# EAGLE schematic power_2 (EAGLE 7.2.0)
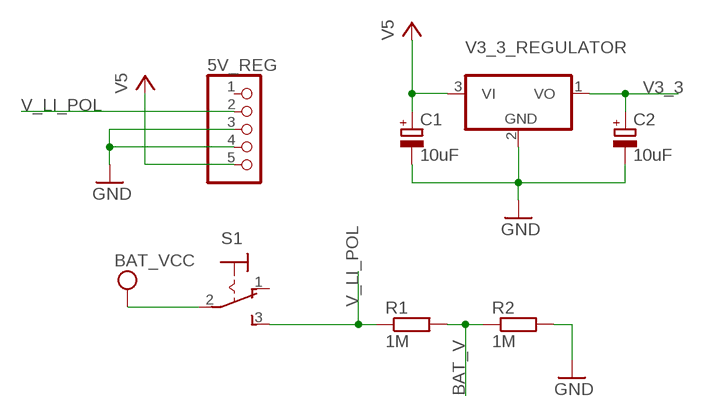
[diagram p0: schematic, sheet 1]

## Parts
5V_REG  PINHD-1X5  [1X05]
C1  10uF  CPOL-EUE5-5  [E5-5]
C2  10uF  CPOL-EUE5-5  [E5-5]
R1  1M  R-EU_0309/10  [0309/10]
R2  1M  R-EU_0309/10  [0309/10]
S1  320-916  [320-916]
V3_3_REGULATOR  7815L  [TO92]

## Nets
BAT_V: R1.2 R2.1
GND: 5V_REG.3 5V_REG.4 C1.- C2.- R2.2 V3_3_REGULATOR.2(GND)
V3_3: C2.+ V3_3_REGULATOR.1(VO)
V_LI_POL: 5V_REG.2 R1.1 S1.3(S)
VCC: 5V_REG.5 C1.+ S1.2(P) V3_3_REGULATOR.3(VI) ; supply symbol labelled V5, BAT_VCC
Unconnected: 5V_REG.1 S1.1(O)

## Library data of the parts
5V_REG = pinhead:PINHD-1X5: PIN HEADER
C1 C2 = resistor:CPOL-EU: POLARIZED CAPACITOR, European symbol
R1 R2 = resistor:R-EU_: RESISTOR, European symbol
S1 = switch:320-916: TOGGLE SWITCH distributor RS Components
V3_3_REGULATOR = linear:78*: Positive VOLTAGE REGULATOR Source: http://cache.national.com/ds/LM/LM78L05.pdf http://www.fairchildsemi.com/ds/LM/LM7805.pdf